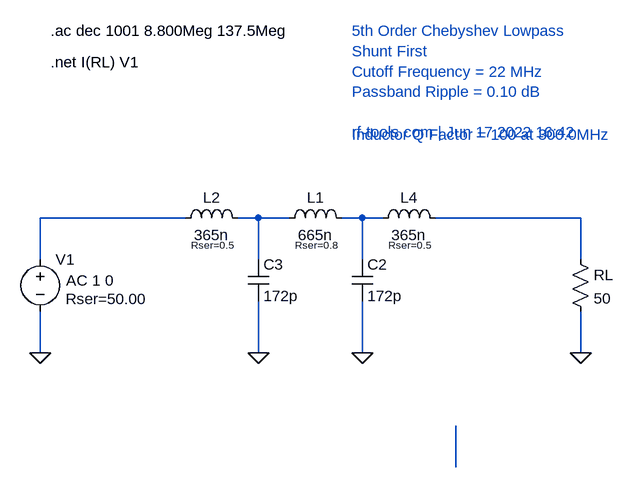
[diagram p0: schematic 21M.asc]
21M.asc, the LTspice schematic file:
Version 4
SHEET 1 1200 400
WIRE 224 0 0 0
WIRE 336 0 304 0
WIRE 384 0 336 0
WIRE 496 0 464 0
WIRE 528 0 496 0
WIRE 832 0 608 0
WIRE 0 64 0 0
WIRE 336 64 336 0
WIRE 496 64 496 0
WIRE 832 64 832 0
WIRE 0 208 0 144
WIRE 336 208 336 128
WIRE 496 208 496 128
WIRE 832 208 832 144
WIRE 640 384 640 320
FLAG 0 208 0
FLAG 336 208 0
FLAG 832 208 0
FLAG 496 208 0
SYMBOL voltage 0 48 R0
WINDOW 123 40 48 Left 2
WINDOW 39 39 77 Left 2
SYMATTR Value2 AC 1 0
SYMATTR SpiceLine Rser=50.00
SYMATTR InstName V1
SYMATTR Value ""
SYMBOL ind 208 16 R270
WINDOW 0 32 56 VTop 2
WINDOW 3 5 56 VBottom 2
WINDOW 39 -36 57 VTop 1
SYMATTR InstName L2
SYMATTR Value 365n
SYMATTR SpiceLine Rser=0.5
SYMBOL cap 320 64 R0
SYMATTR InstName C3
SYMATTR Value 172p
SYMBOL ind 512 16 R270
WINDOW 0 32 56 VTop 2
WINDOW 3 5 56 VBottom 2
WINDOW 39 -36 57 VTop 1
SYMATTR InstName L4
SYMATTR Value 365n
SYMATTR SpiceLine Rser=0.5
SYMBOL res 816 48 R0
SYMATTR InstName RL
SYMATTR Value 50
SYMBOL ind 368 16 R270
WINDOW 0 32 56 VTop 2
WINDOW 3 5 56 VBottom 2
WINDOW 39 -36 57 VTop 1
SYMATTR InstName L1
SYMATTR Value 665n
SYMATTR SpiceLine Rser=0.8
SYMBOL cap 480 64 R0
SYMATTR InstName C2
SYMATTR Value 172p
TEXT 16 -288 Left 2 !.ac dec 1001 8.800Meg 137.5Meg
TEXT 16 -240 Left 2 !.net I(RL) V1
TEXT 480 -288 Left 2 ;5th Order Chebyshev Lowpass\nShunt First\nCutoff Frequency = 22 MHz\nPassband Ripple = 0.10 dB\n\nrf-tools.com | Jun 17 2022 16:42
TEXT 480 -128 Left 2 ;Inductor Q Factor = 100 at 300.0MHz

The netlist it stands for:
* 21M.asc
V1 N001 0 AC 1 0 Rser=50.00
L2 N001 N002 365n Rser=0.5
C3 N002 0 172p
L4 N003 N004 365n Rser=0.5
RL N004 0 50
L1 N002 N003 665n Rser=0.8
C2 N003 0 172p
.ac dec 1001 8.800Meg 137.5Meg
.net I(RL) V1
* 5th Order Chebyshev Lowpass
* Shunt First
* Cutoff Frequency = 22 MHz
* Passband Ripple = 0.10 dB
* rf-tools.com | Jun 17 2022 16:42
* Inductor Q Factor = 100 at 300.0MHz
.backanno
.end